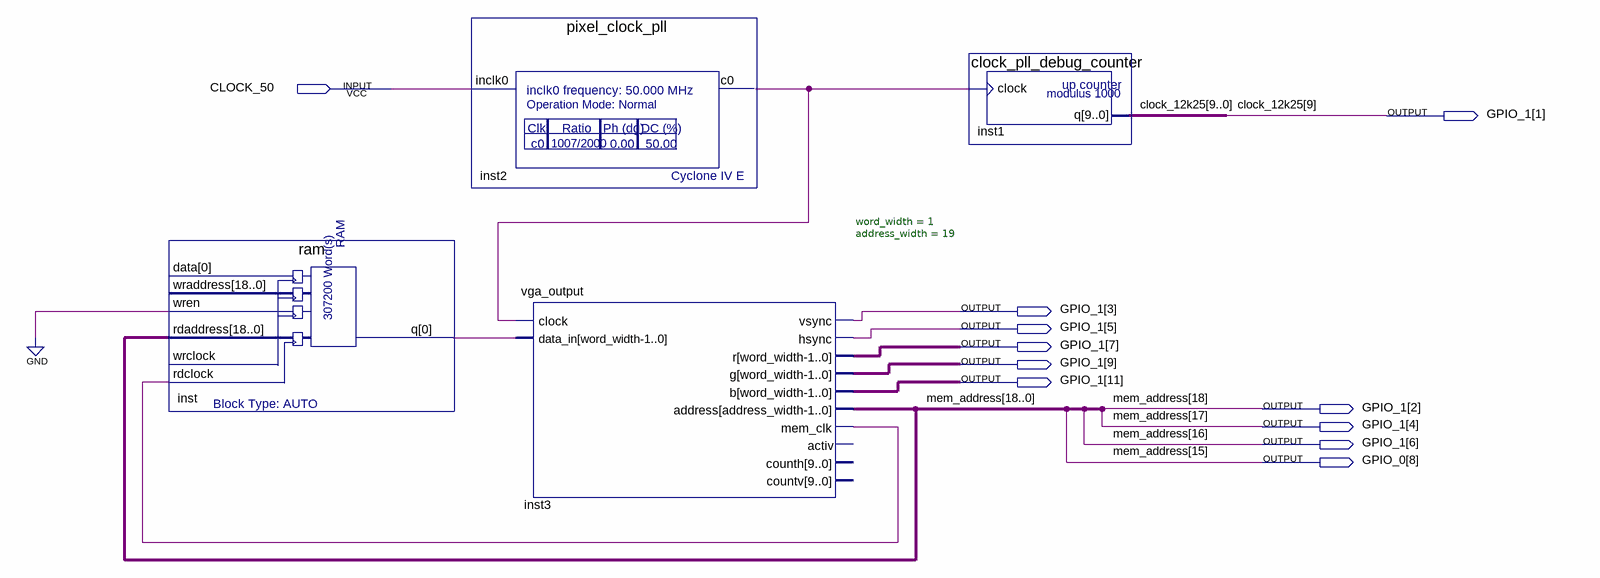
[diagram p0: schematic sheet]
// Quartus schematic cyclops_vga.bdf as structural Verilog: 4 symbols, 11 pins
module cyclops_vga (
  input  CLOCK_50,
  output [11:1] GPIO_1,
  output [8:8] GPIO_0
);

  wire inst2_c0, inst3_mem_clk, inst_q;
  wire [8:0] clock_12k25;
  wire [14:0] mem_address;

  ram inst (
    .wren(1'b0), .rdaddress({GPIO_1[2], GPIO_1[4], GPIO_1[6], GPIO_0[8], mem_address}),
    .rdclock(inst3_mem_clk), .q(inst_q));  // open: data, wraddress, wrclock
  pixel_clock_pll inst2 (.inclk0(CLOCK_50), .c0(inst2_c0));
  vga_output #(.word_width(1), .address_width(19)) inst3 (
    .clock(inst2_c0), .data_in(inst_q), .vsync(GPIO_1[3]), .hsync(GPIO_1[5]), .r(GPIO_1[7]), .g(GPIO_1[9]),
    .b(GPIO_1[11]), .address({GPIO_1[2], GPIO_1[4], GPIO_1[6], GPIO_0[8], mem_address}),
    .mem_clk(inst3_mem_clk));  // open: activ, counth, countv
  clock_pll_debug_counter inst1 (.clock(inst2_c0), .q({GPIO_1[1], clock_12k25}));

  // Other names for the same wires on the sheet: clock_12k25[9] = GPIO_1[1];
  //   mem_address[18:15] = {GPIO_1[2], GPIO_1[4], GPIO_1[6], GPIO_0[8]}
endmodule
